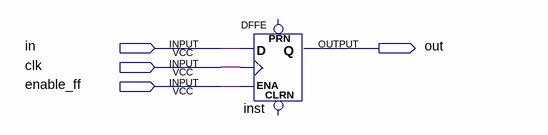
[diagram p0: schematic sheet]
// Quartus schematic ffdConEnable.bdf as structural Verilog: 1 symbols, 4 pins
module ffdConEnable (
  input  in,
  input  clk,
  input  enable_ff,
  output out
);

  DFFE inst (.D(in), .CLK(clk), .ENA(enable_ff), .Q(out));  // open: PRN, CLRN
endmodule
